# EAGLE schematic MAX4239_breakout (EAGLE 8.5.1)
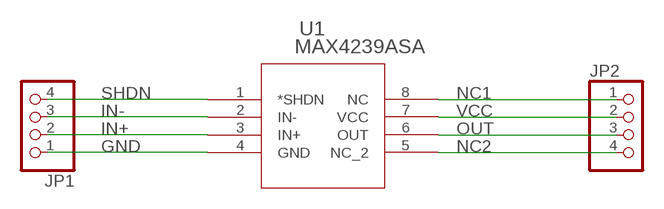
[diagram p0: schematic, sheet 1]

## Parts
JP1  PINHD-1X4  [1X04]
JP2  PINHD-1X4  [1X04]
U1  MAX4239ASA  [21-0041B_8]

## Nets
GND: JP1.1 U1.4(GND)
IN+: JP1.2 U1.3(IN+)
IN-: JP1.3 U1.2(IN-)
NC1: JP2.1 U1.8(NC)
NC2: JP2.4 U1.5(NC_2)
OUT: JP2.3 U1.6(OUT)
SHDN: JP1.4 U1.1(*SHDN)
VCC: JP2.2 U1.7(VCC)

## Library data of the parts
JP1 JP2 = pinhead:PINHD-1X4: PIN HEADER
U1 = MAX4239ASA:MAX4239ASA; AVAILABILITY: Warning; DESCRIPTION: Linear IC - Op-amp Maxim Integrated MAX4239ASA+ Multi-purpose SOIC 8 N; MF: Maxim Integrated; MP: MAX4239ASA+; PACKAGE: SOIC-8 Maxim Integrated; PRICE: 2.22 USD